# EAGLE design motobone1 (EAGLE 6.4)
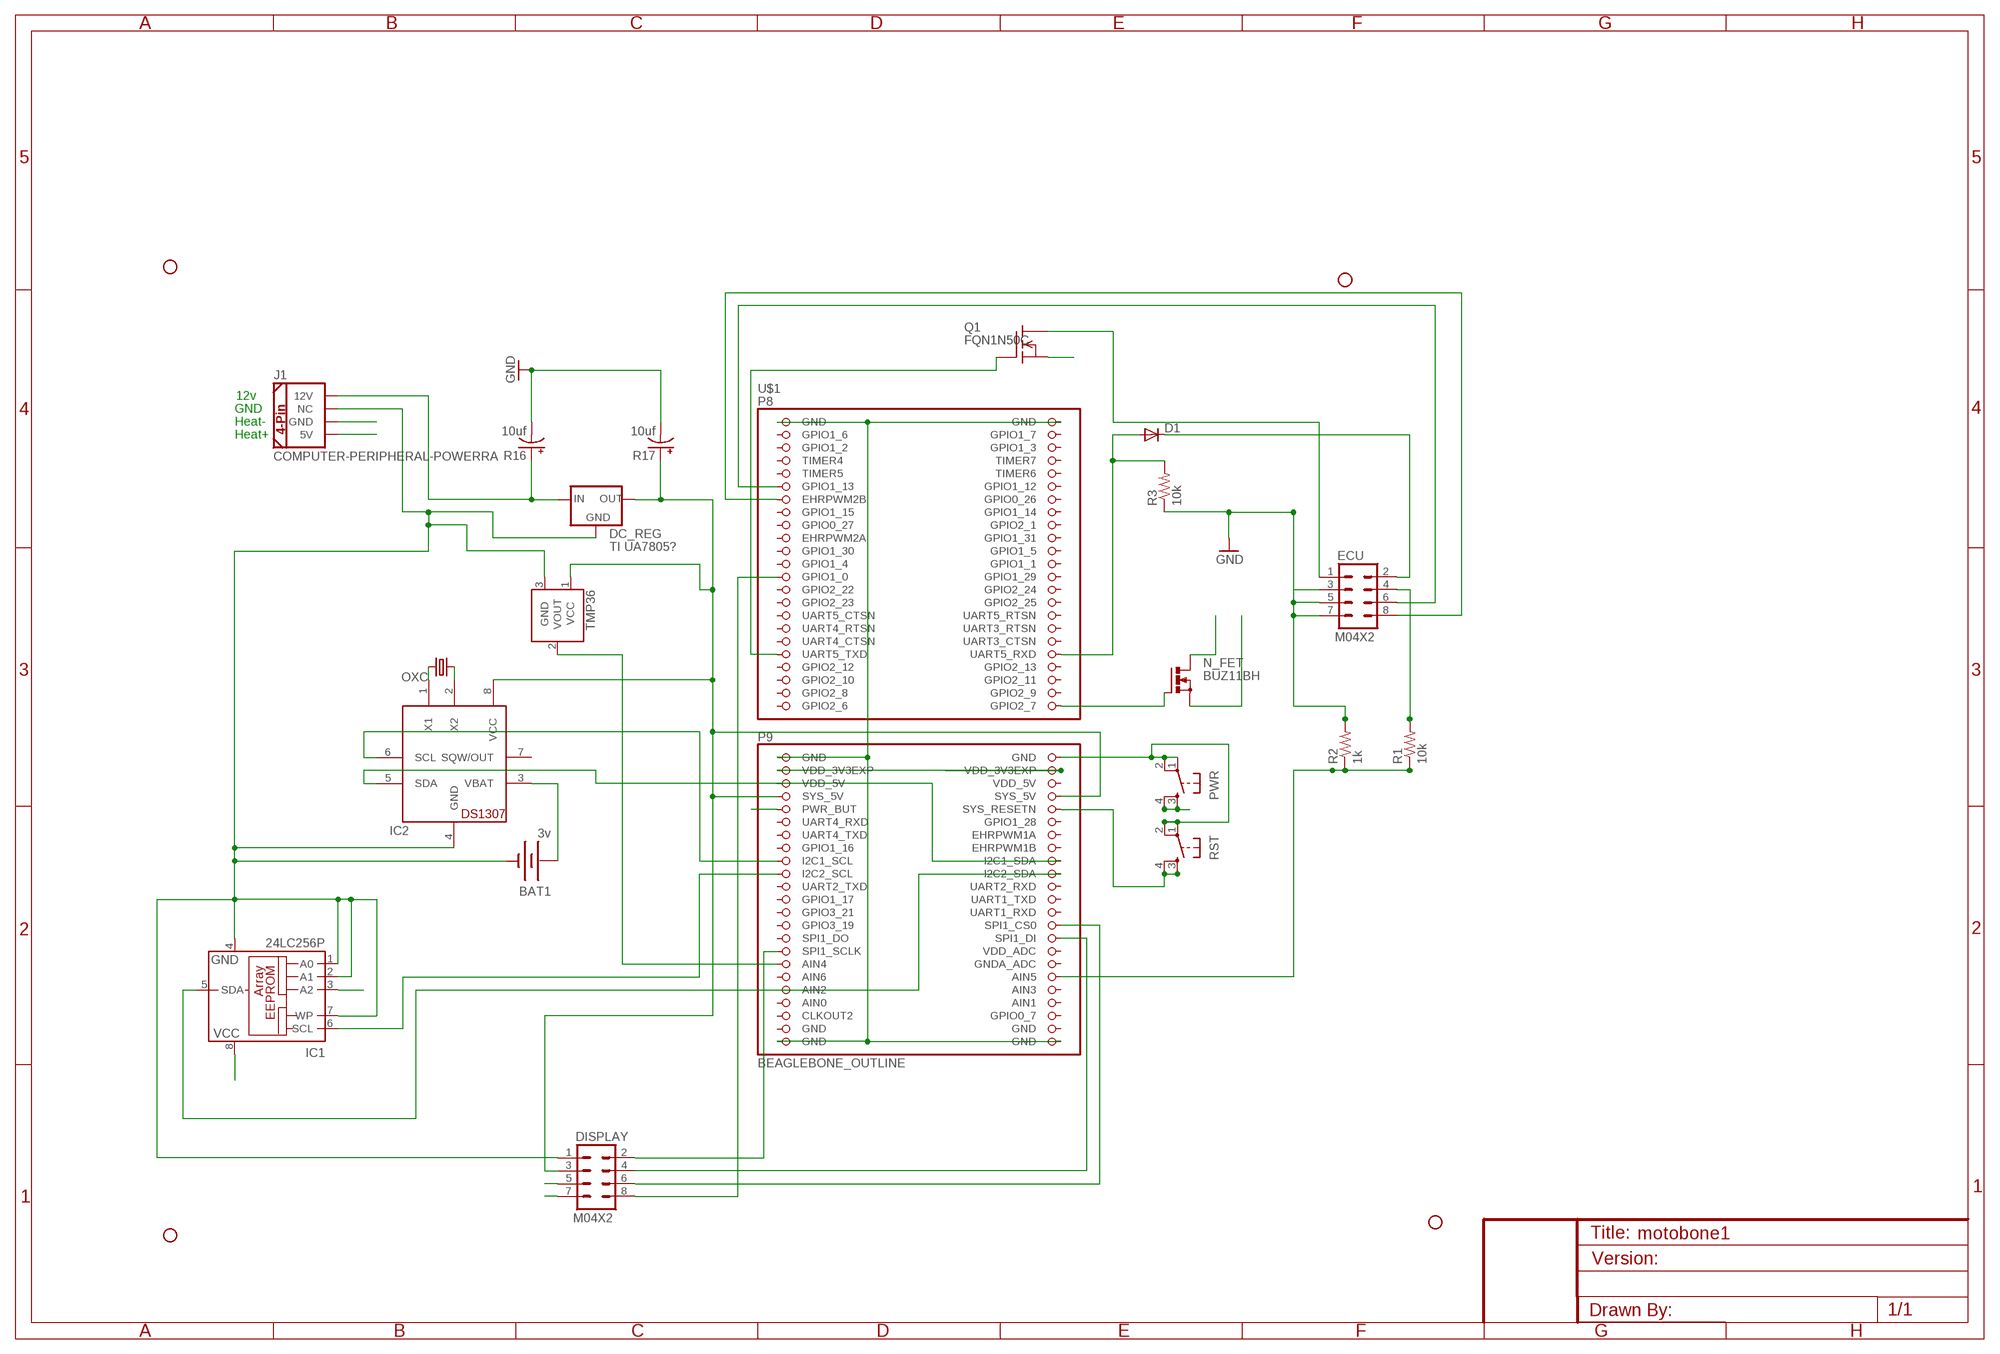
[diagram p0: schematic, sheet 1]

## Parts
BAT1  3v  BATTERY12PTH  [BATTCON_12MM_PTH]
D1  DIODE1N4148  [DIODE-1N4148]
DC_REG  TI UA7805?  V_REG_78XXSIDE  [78XXL]
DISPLAY  M04X2  [2X4]
ECU  M04X2  [2X4]
IC1  24LC256P  [DIL8]
IC2  DS1307  [DIL08]
J1  COMPUTER-PERIPHERAL-POWERRA  [COMPUTER-PERIPHERAL-POWER-RA]
N_FET  BUZ11BH  [TO220BH]
OXC  CRYSTALTC38H  [TC38H]
PWR  TAC_SWITCHPTH  [TACTILE-PTH]
Q1  FQN1N50C  [TO92]
R1  10k  RESISTOR1206  [1206]
R2  1k  RESISTOR1206  [1206]
R3  10k  RESISTOR1206  [1206]
R16  10uf  10UF-TANT  [EIA3216]
R17  10uf  10UF-TANT  [EIA3216]
RST  TAC_SWITCHPTH  [TACTILE-PTH]
STANDOFF1  STAND-OFF  [STAND-OFF]
STANDOFF2  STAND-OFF  [STAND-OFF]
STANDOFF3  STAND-OFF  [STAND-OFF]
STANDOFF4  STAND-OFF  [STAND-OFF]
TMP36  TMP36GT9  [TO-92]
U$1  BEAGLEBONE_OUTLINE  [BEAGLEBONE_SHIELD]

## Nets
12V [12v_power]: DC_REG.IN J1.12V R16.A(+)
12V_ECU: ECU.4 R1.2
GND [GND]: BAT1.GND(-) DC_REG.GND DISPLAY.1 ECU.3 ECU.5 ECU.7 IC1.1(A0) IC1.2(A1) IC1.4(GND) IC1.7(WP) IC2.4(GND) J1.NC PWR.1 PWR.2 R2.2 R3.1 R16.C(-) R17.C(-) RST.1 RST.2 TMP36.3(GND) U$1.1(GND) U$1.2(GND) U$1.47(GND) U$1.48(GND) U$1.91(GND) U$1.92(GND)
HEAT+ [Heat]: J1.5V N_FET.S
HEAT- [Heat]: J1.GND N_FET.D
HEAT_GPIO: N_FET.G U$1.46(GPIO2_7)
N$1: DISPLAY.4 U$1.76(SPI1_DI)
N$2: IC2.6(SCL) U$1.63(I2C1_SCL)
N$3: DISPLAY.2 U$1.77(SPI1_SCLK)
N$4: TMP36.2(VOUT) U$1.79(AIN4)
N$5: IC2.2(X2) OXC.1
N$6: IC2.1(X1) OXC.2
N$7: IC2.5(SDA) U$1.64(I2C1_SDA)
N$8: BAT1.VCC@1(+) IC2.3(VBAT)
N$9: IC1.6(SCL) U$1.65(I2C2_SCL)
N$10: IC1.5(SDA) U$1.66(I2C2_SDA)
N$11: DISPLAY.6 U$1.74(SPI1_CS0)
N$12: Q1.1(G) U$1.37(UART5_TXD)
N$13: ECU.6 U$1.11(GPIO1_13)
N$14: ECU.8 U$1.13(EHRPWM2B)
N$17: R1.1 R2.1 U$1.82(AIN5)
N$22: DISPLAY.8 U$1.25(GPIO1_0)
N$24: D1.C ECU.2
N$25: D1.A R3.2 U$1.38(UART5_RXD)
N$26: ECU.1 Q1.2(D)
PWR_BTN: DISPLAY.7 PWR.3 PWR.4 U$1.55(PWR_BUT)
RST_BTN: DISPLAY.5 RST.3 RST.4 U$1.56(SYS_RESETN)
SYS_5V [5v_power]: DC_REG.OUT DISPLAY.3 IC1.3(A2) IC2.8(VCC) Q1.3(S) R17.A(+) TMP36.1(VCC) U$1.53(SYS_5V) U$1.54(SYS_5V)
VDD_3V3: IC1.8(VCC) U$1.49(VDD_3V3EXP) U$1.50(VDD_3V3EXP)
Unconnected: IC2.7(SQW/OUT) U$1.3(GPIO1_6) U$1.4(GPIO1_7) U$1.5(GPIO1_2) U$1.6(GPIO1_3) U$1.7(TIMER4) U$1.8(TIMER7) U$1.9(TIMER5) U$1.10(TIMER6) U$1.12(GPIO1_12) U$1.14(GPIO0_26) U$1.15(GPIO1_15) U$1.16(GPIO1_14) U$1.17(GPIO0_27) U$1.18(GPIO2_1) U$1.19(EHRPWM2A) U$1.20(GPIO1_31) U$1.21(GPIO1_30) U$1.22(GPIO1_5) U$1.23(GPIO1_4) U$1.24(GPIO1_1) U$1.26(GPIO1_29) U$1.27(GPIO2_22) U$1.28(GPIO2_24) U$1.29(GPIO2_23) U$1.30(GPIO2_25) U$1.31(UART5_CTSN) U$1.32(UART5_RTSN) U$1.33(UART4_RTSN) U$1.34(UART3_RTSN) U$1.35(UART4_CTSN) U$1.36(UART3_CTSN) U$1.39(GPIO2_12) U$1.40(GPIO2_13) U$1.41(GPIO2_10) U$1.42(GPIO2_11) U$1.43(GPIO2_8) U$1.44(GPIO2_9) U$1.45(GPIO2_6) U$1.57(UART4_RXD) U$1.58(GPIO1_28) U$1.59(UART4_TXD) U$1.60(EHRPWM1A) U$1.61(GPIO1_16) U$1.62(EHRPWM1B) U$1.67(UART2_TXD) U$1.68(UART2_RXD) U$1.69(GPIO1_17) U$1.70(UART1_TXD) U$1.71(GPIO3_21) U$1.72(UART1_RXD) U$1.73(GPIO3_19) U$1.75(SPI1_DO) U$1.78(VDD_ADC) U$1.80(GNDA_ADC) U$1.81(AIN6) U$1.83(AIN2) U$1.84(AIN3) U$1.86(AIN1) U$1.87(CLKOUT2) U$1.88(GPIO0_7)

## Notes on the sheet
- 12v
- GND
- Heat-
- Heat+

## Power pins joined to a net without a drawn wire
AIN0: U$1.85(AIN0)
GND: U$1.89(GND) U$1.90(GND)
VDD_5V: U$1.51(VDD_5V) U$1.52(VDD_5V)

## Library data of the parts
BAT1 = SparkFun-Electromechanical:BATTERY: Battery Holders Various common sizes : AA, AAA, 20mm coin cell and 12mm coin cell. 20MM_4LEGS, BATT-10373
D1 = SparkFun-DiscreteSemi:DIODE: Diode These are standard reverse protection diodes and small signal diodes. SMA package can handle up to about 1A. SOD-323 can handle about 200mA. What the SOD-323 package when ordering, there are some mfgs out there that are 5-pin packages.
DC_REG = SparkFun-PowerIC:V_REG_78XX: Voltage Regulator Standard 7805 5V regulator. IGO (Input Ground Output). Spark Fun Electronics SKU : COM-00107
DISPLAY ECU = SparkFun-Connectors:M04X2: .1" header, two rows of four.
IC1 = microchip:24*: Serial EEPROM I2C; MF: MICROCHIP; MPN: 24LC256-E/P; OC_FARNELL: 9757970; OC_NEWARK: 92C7169
IC2 = adafruit:DS1307: DS1307 Real time clock (RTC) with battery backup ability. Talk to it via i2c
J1 = SparkFun-Connectors:COMPUTER-PERIPHERAL-POWER
N_FET = transistor-power:BUZ11: N-CHANNEL MOS FET
OXC = crystal:CRYSTAL: CRYSTAL; OC_FARNELL: unknown; OC_NEWARK: unknown
PWR RST = SparkFun-Electromechanical:TAC_SWITCH: Momentary Switch Button commonly used for reset or general input. Spark Fun Electronics SKU : COM-00097 SMT- SWCH-08247
Q1 = adafruit:FQN1N50C: N-Channel Enhancement MOSFET 500V, 0.4A, 6.0 Ohm
R1-R3 = SparkFun-Resistors:RESISTOR: Resistor Basic schematic elements and footprints for 0603, 1206, and PTH resistors.
R16 R17 = SparkFun-Capacitors:10UF-TANT: 10uF Tantalum SMT CAP-00811- 16V 10% (EIA-3216); PROD_ID: CAP-00811; VALUE: 10uF
STANDOFF1-STANDOFF4 = SparkFun-Electromechanical:STAND-OFF: #4 Stand Off This is the mechanical footprint for a #4 phillips button head screw. Use the keepout ring to avoid running the screw head into surrounding components. SKU : PRT-00447
TMP36 = SparkFun-Sensors:TMP36: Precision degC temp sensor, analog out
U$1 = adafruit:BEAGLEBONE_OUTLINE: Should match A3 pinout - but not completely tested

## Net classes
0 default: width 0.254 mm, drill 0.254 mm, clearance 0.254 mm
1 12v_power: width 0.762 mm, drill 0.254 mm, clearance 0.254 mm
2 5v_power: width 0.762 mm, drill 0.254 mm, clearance 0.254 mm
3 GND: width 0.762 mm, drill 0.254 mm, clearance 0.254 mm
4 Heat: width 2.54 mm, drill 0.254 mm, clearance 0.254 mm

## Board
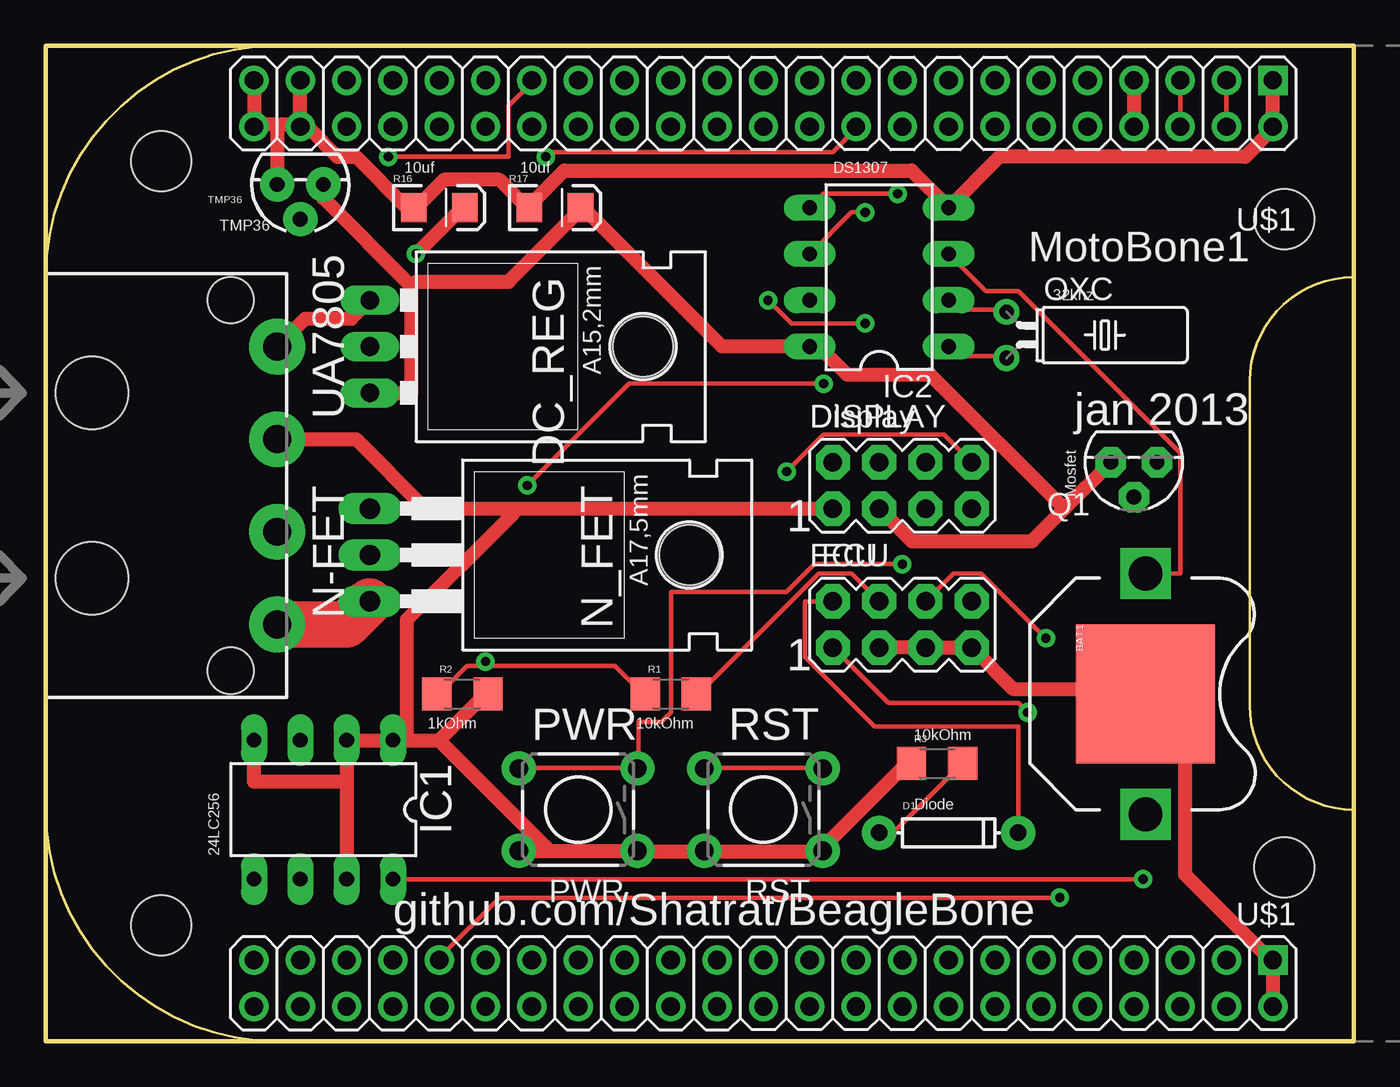
[diagram p1: board, top side]
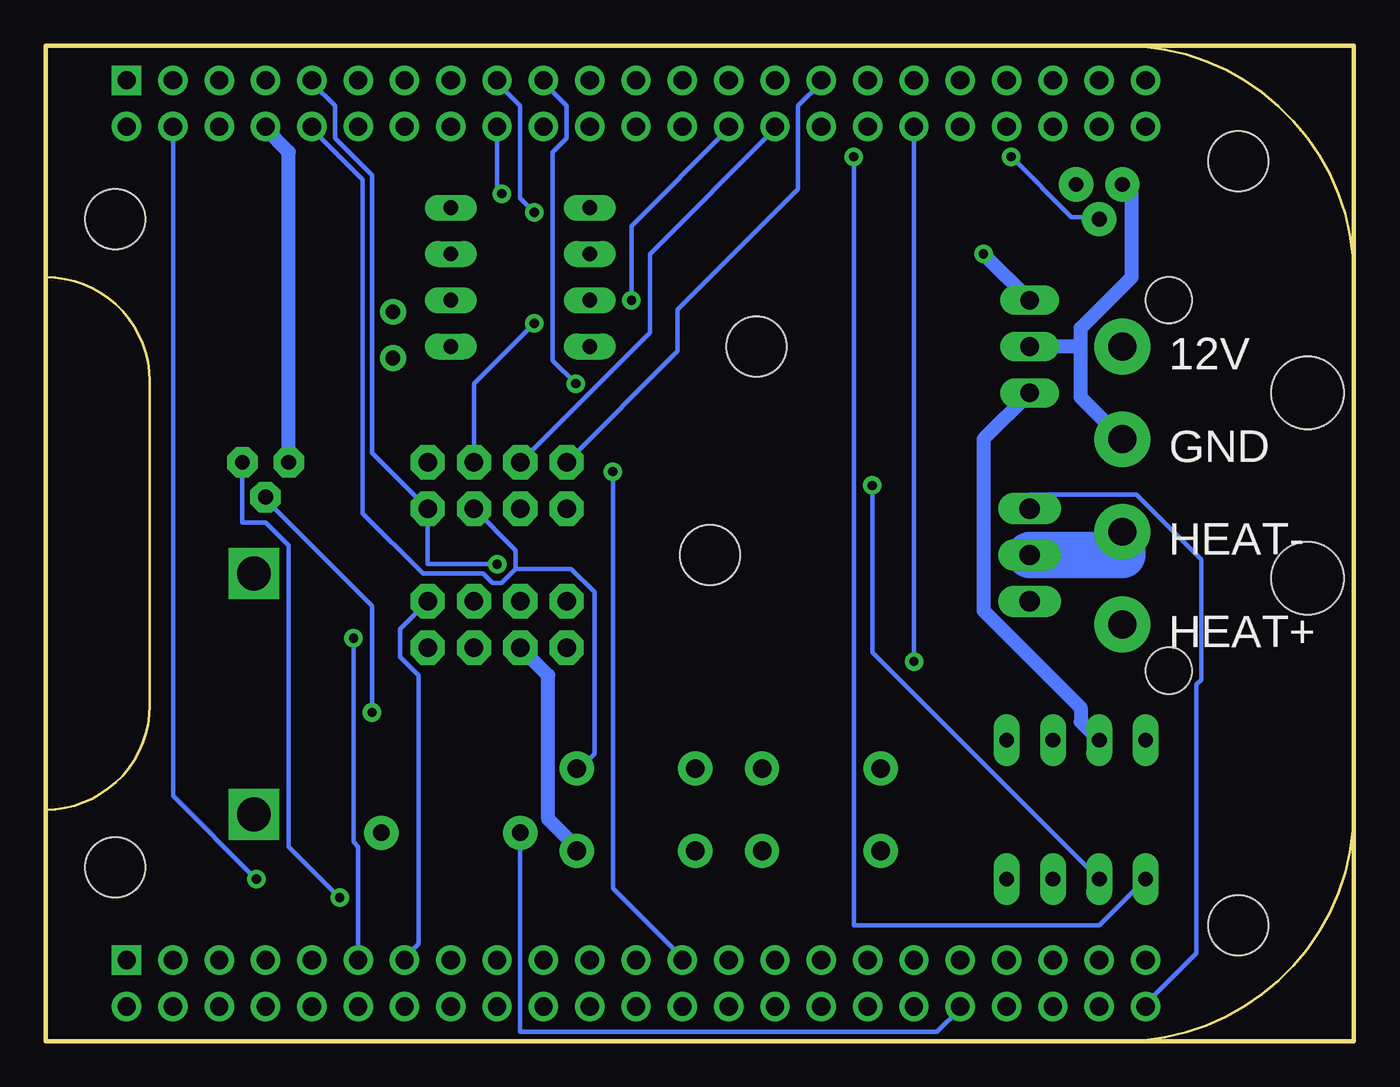
[diagram p2: board, bottom side, seen from below]

Size 71.75 x 54.61 mm. Coordinates in mm from the lower left corner, seen from the top.
Outline: 0,0 71.75,0 71.75,54.61 0,54.6 0,0
Copper layers (1*16): Top 0.035mm / dielectric 1.5mm / Bottom 0.035mm
Design rules "SparkFun": minimum track width 8mil, minimum drill 20mil, track to track 8mil, track to pad 8mil, pad to pad 8mil, via to via 8mil, smd to smd 8mil, copper to edge 10mil, drill to drill 8mil, minimum pad ring 12mil, minimum via ring 10mil, stop-mask expansion 4mil, vias tented up to drill 25mil, thermal gap 10mil

### Footprints (pad centres in the part's own frame; a part is rotated, then mirrored left to right if it is on the bottom)
BATTCON_12MM_PTH = smd 7.62 x 7.62: GND 0,0 | drill 1.854 square: VCC@1 -6.604,0; VCC@2 6.604,0
DIODE-1N4148 = drill 0.9 pad 1.88: A -3.81,0; C 3.81,0
78XXL = drill 1.016 long: GND 0,-3.81; IN -2.54,-3.81; OUT 2.54,-3.81 | hole 3.302: 0,11.176
2X4 = drill 1.016 pad 1.88 octagon: 1 -3.81,-1.27; 2 -3.81,1.27; 3 -1.27,-1.27; 4 -1.27,1.27; 5 1.27,-1.27; 6 1.27,1.27; 7 3.81,-1.27; 8 3.81,1.27
DIL8 = drill 0.813 long: 1 -3.81,-3.81; 2 -1.27,-3.81; 3 1.27,-3.81; 4 3.81,-3.81; 5 3.81,3.81; 6 1.27,3.81; 7 -1.27,3.81; 8 -3.81,3.81
DIL08 = drill 0.813 long: 1 -3.81,-3.81; 2 -1.27,-3.81; 3 1.27,-3.81; 4 3.81,-3.81; 5 3.81,3.81; 6 1.27,3.81; 7 -1.27,3.81; 8 -3.81,3.81
COMPUTER-PERIPHERAL-POWER-RA = drill 1.524 pad 3.048: 5V -7.62,-2.54; 12V 7.62,-2.54; GND -2.54,-2.54; NC 2.54,-2.54 | hole 2.54: -10.16,0; 10.16,0 | hole 3.988: -5.08,7.62; 5.08,7.62
TO220BH = drill 1.118 long: D 0,-6.35; G -2.54,-6.35; S 2.54,-6.35 | hole 3.302: 0,11.176
TC38H = drill 0.813: 1 -1.27,0; 2 1.27,0
TACTILE-PTH = drill 1.016 pad 1.88: 1 -3.251,2.261; 2 3.251,2.261; 3 -3.251,-2.261; 4 3.251,-2.261
TO92 = drill 0.813 pad 1.676 octagon: 1 -1.27,0; 2 0,1.905; 3 1.27,0
1206 = smd 1.6 x 1.8: 1 -1.4,0; 2 1.4,0
EIA3216 = smd 1.4 x 1.6: A 1.4,0; C -1.4,0
STAND-OFF = hole 3.302: 0,0
TO-92 = drill 0.813 pad 1.88: 1 -1.27,0; 2 0,1.905; 3 1.27,0
BEAGLEBONE_SHIELD = drill 1 square: 1 4.445,19.05; 47 52.705,19.05 | drill 1: 2 1.905,19.05; 3 4.445,21.59; 4 1.905,21.59; 5 4.445,24.13; 6 1.905,24.13; 7 4.445,26.67; 8 1.905,26.67; 9 4.445,29.21; 10 1.905,29.21; 11 4.445,31.75; 12 1.905,31.75; 13 4.445,34.29; 14 1.905,34.29; 15 4.445,36.83; 16 1.905,36.83; 17 4.445,39.37; 18 1.905,39.37; 19 4.445,41.91; 20 1.905,41.91; 21 4.445,44.45; 22 1.905,44.45; 23 4.445,46.99; 24 1.905,46.99; 25 4.445,49.53; 26 1.905,49.53; 27 4.445,52.07; 28 1.905,52.07; 29 4.445,54.61; 30 1.905,54.61; 31 4.445,57.15; 32 1.905,57.15; 33 4.445,59.69; 34 1.905,59.69; 35 4.445,62.23; 36 1.905,62.23; 37 4.445,64.77; 38 1.905,64.77; 39 4.445,67.31; 40 1.905,67.31; 41 4.445,69.85; 42 1.905,69.85; 43 4.445,72.39; 44 1.905,72.39; 45 4.445,74.93; 46 1.905,74.93; 48 50.165,19.05; 49 52.705,21.59; 50 50.165,21.59; 51 52.705,24.13; 52 50.165,24.13; 53 52.705,26.67; 54 50.165,26.67; 55 52.705,29.21; 56 50.165,29.21; 57 52.705,31.75; 58 50.165,31.75; 59 52.705,34.29; 60 50.165,34.29; 61 52.705,36.83; 62 50.165,36.83; 63 52.705,39.37; 64 50.165,39.37; 65 52.705,41.91; 66 50.165,41.91; 67 52.705,44.45; 68 50.165,44.45; 69 52.705,46.99; 70 50.165,46.99; 71 52.705,49.53; 72 50.165,49.53; 73 52.705,52.07; 74 50.165,52.07; 75 52.705,54.61; 76 50.165,54.61; 77 52.705,57.15; 78 50.165,57.15; 79 52.705,59.69; 80 50.165,59.69; 81 52.705,62.23; 82 50.165,62.23; 83 52.705,64.77; 84 50.165,64.77; 85 52.705,67.31; 86 50.165,67.31; 87 52.705,69.85; 88 50.165,69.85; 89 52.705,72.39; 90 50.165,72.39; 91 52.705,74.93; 92 50.165,74.93

### Placement (x,y rotation side)
BAT1  60.33,19.05 270 top
D1  49.53,11.43 0 top
DC_REG  21.59,38.1 270 top
DISPLAY  46.99,30.48 0 top
ECU  46.99,22.86 0 top
IC1  15.24,12.7 180 top
IC2  45.72,41.91 90 top
J1  10.16,30.48 90 top
N_FET  24.13,26.67 270 top
OXC  52.7,38.73 270 top
PWR  29.21,12.7 180 top
Q1  59.69,31.75 180 top
R1  34.29,19.05 0 top
R2  22.86,19.05 0 top
R3  48.9,15.24 0 top
R16  21.59,45.72 0 top
R17  27.94,45.72 0 top
RST  39.37,12.7 180 top
STANDOFF1  6.35,48.26 0 top
STANDOFF2  67.94,9.53 0 top
STANDOFF3  67.94,45.09 0 top
STANDOFF4  6.35,6.35 0 top
TMP36  13.97,46.99 180 top
U$1  86.36,0 90 top

### Tracks (layer width: path | path; a pad name or v marks a point on that pad's centre or on a via)
12V  (via drill 0.51)
  Top 0.762: v20.32,43.18 22.86,45.72 R16.A | DC_REG.IN 16.76,39.62 14.22,39.62 J1.12V
  Bottom 0.762: DC_REG.IN v20.32,43.18
12V_ECU
  Top 0.254: ECU.4 44.2,25.65 42.42,25.65 35.81,19.05 R1.2
GND
  Top 0.762: ECU.3 ECU.5 ECU.7 53.09,19.3 60.2,19.3 BAT1.GND 62.48,19.05 62.48,9.14 67.06,4.57 U$1.1 U$1.2 | 21.59,16.51 24.13,19.05 R2.2 | 19.81,16.51 IC1.1 IC1.2 16.51,14.22 | 19.81,16.51 21.59,16.51 | 16.51,14.22 IC1.7 | IC1.4 11.43,14.22 16.51,14.22 | R3.1 47.24,15.24 42.67,10.67 RST.1 42.42,10.41 36.32,10.41 RST.2 36.07,10.41 32.77,10.41 PWR.1 32.26,10.41 27.43,10.41 | 27.43,10.41 26.16,10.41 PWR.2 | 21.59,16.51 27.43,10.67 27.43,10.41 | U$1.47 U$1.48 67.31,50.04 65.79,48.51 52.32,48.51 IC2.4 47.5,47.75 28.45,47.75 26.67,45.97 R17.C 26.42,45.72 24.89,47.24 21.84,47.24 20.32,45.72 R16.C 19.81,45.72 17.02,48.51 16,48.51 14.48,50.04 14.22,50.04 U$1.90 | U$1.91 U$1.92 11.68,50.29 12.7,50.29 | 12.7,50.29 13.97,50.29 U$1.90 | U$1.90 U$1.89 | 12.7,50.29 TMP36.3 | 25.65,29.21 20.83,29.21 17.02,33.02 J1.NC | 25.65,29.21 DISPLAY.1 | 19.81,16.51 19.81,23.11 25.65,28.96 25.65,29.21
  Bottom 0.762: ECU.3 44.2,20.07 44.2,12.19 42.67,10.67 RST.1 | 14.99,38.1 DC_REG.GND | 14.99,38.1 14.99,35.31 J1.NC | TMP36.3 12.19,46.48 12.19,41.91 14.99,39.12 14.99,38.1
HEAT+
  Top 2.54: N_FET.S 16.51,22.86 J1.5V
HEAT-
  Bottom 2.54: N_FET.D 12.7,26.67 J1.GND
HEAT_GPIO
  Bottom 0.254: N_FET.G 17.78,29.97 11.94,29.97 8.38,26.42 8.38,19.81 8.64,19.56 8.64,4.83 11.43,2.03 U$1.46
N$1
  Bottom 0.254: DISPLAY.4 38.61,38.86 38.61,43.18 31.75,50.04 U$1.76
N$2  (via drill 0.51)
  Top 0.254: IC2.6 44.2,45.47 v44.96,45.47
  Bottom 0.254: v44.96,45.47 45.72,46.23 45.72,51.31 46.99,52.58 U$1.63
N$3
  Bottom 0.254: DISPLAY.2 37.08,37.85 37.08,40.13 30.48,46.74 30.48,51.31 29.21,52.58 U$1.77
N$4  (via drill 0.51)
  Top 0.254: v18.8,48.51 25.4,48.51 25.4,51.31 26.67,52.58 U$1.79
  Bottom 0.254: v18.8,48.51 15.49,45.21 13.97,45.21 TMP36.2
N$5
  Top 0.254: IC2.2 50.04,40.13 52.58,40.13 OXC.1
N$6
  Top 0.254: IC2.1 50.04,37.59 52.58,37.59 OXC.2
N$7  (via drill 0.51)
  Top 0.254: IC2.5 42.67,46.48 v46.74,46.48
  Bottom 0.254: v46.74,46.48 46.99,46.74 U$1.64
N$8
  Top 0.254: IC2.3 51.56,41.15 53.34,41.15 62.23,32.26 62.23,25.65 BAT1.VCC@1
N$9  (via drill 0.51)
  Top 0.254: v26.42,30.48 32,36.07 v42.67,36.07
  Bottom 0.254: IC1.6 26.42,21.34 v26.42,30.48 | v42.67,36.07 43.94,37.34 43.94,48.77 43.18,49.53 43.18,51.31 44.45,52.58 U$1.65
N$10  (via drill 0.51)
  Top 0.254: v27.43,48.51 27.69,48.77 43.18,48.77 44.45,50.04 U$1.66
  Bottom 0.254: IC1.5 13.97,6.35 27.43,6.35 v27.43,48.51
N$11  (via drill 0.51)
  Top 0.254: v39.62,40.64 40.89,39.37 v44.96,39.37
  Bottom 0.254: v39.62,40.64 39.62,44.7 34.29,50.04 U$1.74 | v44.96,39.37 48.26,36.07 DISPLAY.6
N$12  (via drill 0.51)
  Top 0.254: v55.63,7.87 24.89,7.87 21.59,4.57 U$1.37
  Bottom 0.254: v55.63,7.87 58.42,10.67 58.42,27.18 59.69,28.45 60.96,28.45 Q1.1
N$13  (via drill 0.51)
  Top 0.254: v54.86,22.1 51.31,25.65 49.78,25.65 ECU.6
  Bottom 0.254: U$1.11 54.61,10.67 54.86,10.92 v54.86,22.1
N$14
  Bottom 0.254: ECU.8 52.32,22.61 52.32,21.08 51.31,20.07 51.31,5.33 52.07,4.57 U$1.13
N$17  (via drill 0.51)
  Top 0.254: 24.13,20.57 31.24,20.57 32.77,19.05 R1.1 | 24.13,20.57 23.11,20.57 21.59,19.05 R2.1 | 24.13,20.57 v24.13,20.83
  Bottom 0.254: v24.13,20.83 U$1.82
N$22  (via drill 0.51)
  Top 0.254: v40.64,31.24 42.67,33.27 49.28,33.27 DISPLAY.8
  Bottom 0.254: v40.64,31.24 40.64,8.38 36.83,4.57 U$1.25
N$24
  Top 0.254: D1.C 53.34,17.27 45.47,17.27 41.66,21.08 41.66,24.13 ECU.2
N$25
  Top 0.254: D1.A 46.48,11.43 R3.2
  Bottom 0.254: D1.A 45.72,0.51 22.86,0.51 21.59,1.78 U$1.38
N$26  (via drill 0.51)
  Top 0.254: v53.85,18.03 53.34,18.54 46.23,18.54 ECU.1
  Bottom 0.254: v53.85,18.03 53.85,23.88 59.69,29.72 Q1.2
PWR_BTN  (via drill 0.51)
  Top 0.254: PWR.4 26.16,14.99 32.26,14.99 PWR.3 32.51,14.99 32.51,17.53 33.78,17.53 34.29,18.03 34.29,24.64 40.64,24.64 42.16,26.16 v46.99,26.16
  Bottom 0.254: U$1.55 57.15,52.58 55.88,51.31 55.88,49.53 53.85,47.5 53.85,32.26 DISPLAY.7 50.8,26.16 v46.99,26.16
RST_BTN
  Top 0.254: RST.4 36.32,14.99 42.42,14.99 RST.3
  Bottom 0.254: 45.97,25.91 46.74,25.15 47.24,25.15 47.75,25.65 51.05,25.65 54.36,28.96 54.36,47.24 57.15,50.04 U$1.56 | 45.97,25.91 45.97,26.92 DISPLAY.5 | 45.97,25.91 42.93,25.91 41.66,24.64 41.66,15.75 42.42,14.99 RST.3
SYS_5V
  Top 0.762: U$1.53 U$1.54 | 55.88,29.21 54.1,27.43 47.5,27.43 DISPLAY.3 | 55.88,29.21 Q1.3 | TMP36.1 15.24,46.23 20.07,41.4 | 20.07,41.4 20.07,35.56 DC_REG.OUT | 20.07,41.4 20.32,41.66 25.4,41.66 29.21,45.47 R17.A 29.46,45.72 37.08,38.1 IC2.8 42.16,37.85 42.67,37.85 43.94,36.58 48.51,36.58 55.88,29.21
  Bottom 0.762: Q1.3 58.42,48.77 59.69,50.04 U$1.54 | IC1.3 14.99,17.53 14.99,18.29 20.32,23.62 20.32,33.02 DC_REG.OUT
VDD_3V3  (via drill 0.51)
  Top 0.254: v60.2,8.89 IC1.8 | U$1.50 U$1.49
  Bottom 0.254: v60.2,8.89 64.77,13.46 U$1.50
VDD_5V
  Top 0.254: U$1.51 U$1.52

### Text on the board
tPlace: 10uf | 10uf | DS1307 | TMP36 | MotoBone1 | UA7805 | 32khz | jan 2013 | Display | N-FET | Mosfet | 1 | ECU | 1 | 1kOhm | PWR | 10kOhm | RST | 10kOhm | Diode | 24LC256 | github.com/Shatrat/BeagleBone
bPlace: 12V | GND | HEAT- | HEAT+